# EasyEDA schematic 1-Schematic_Automatic watering Pump shield.json
TITLE: Pump Shield; REV: 1.0; Date: 2019-09-20; Sheet: 1/1; Drawn By: Tomáš Filo; Company: DIY
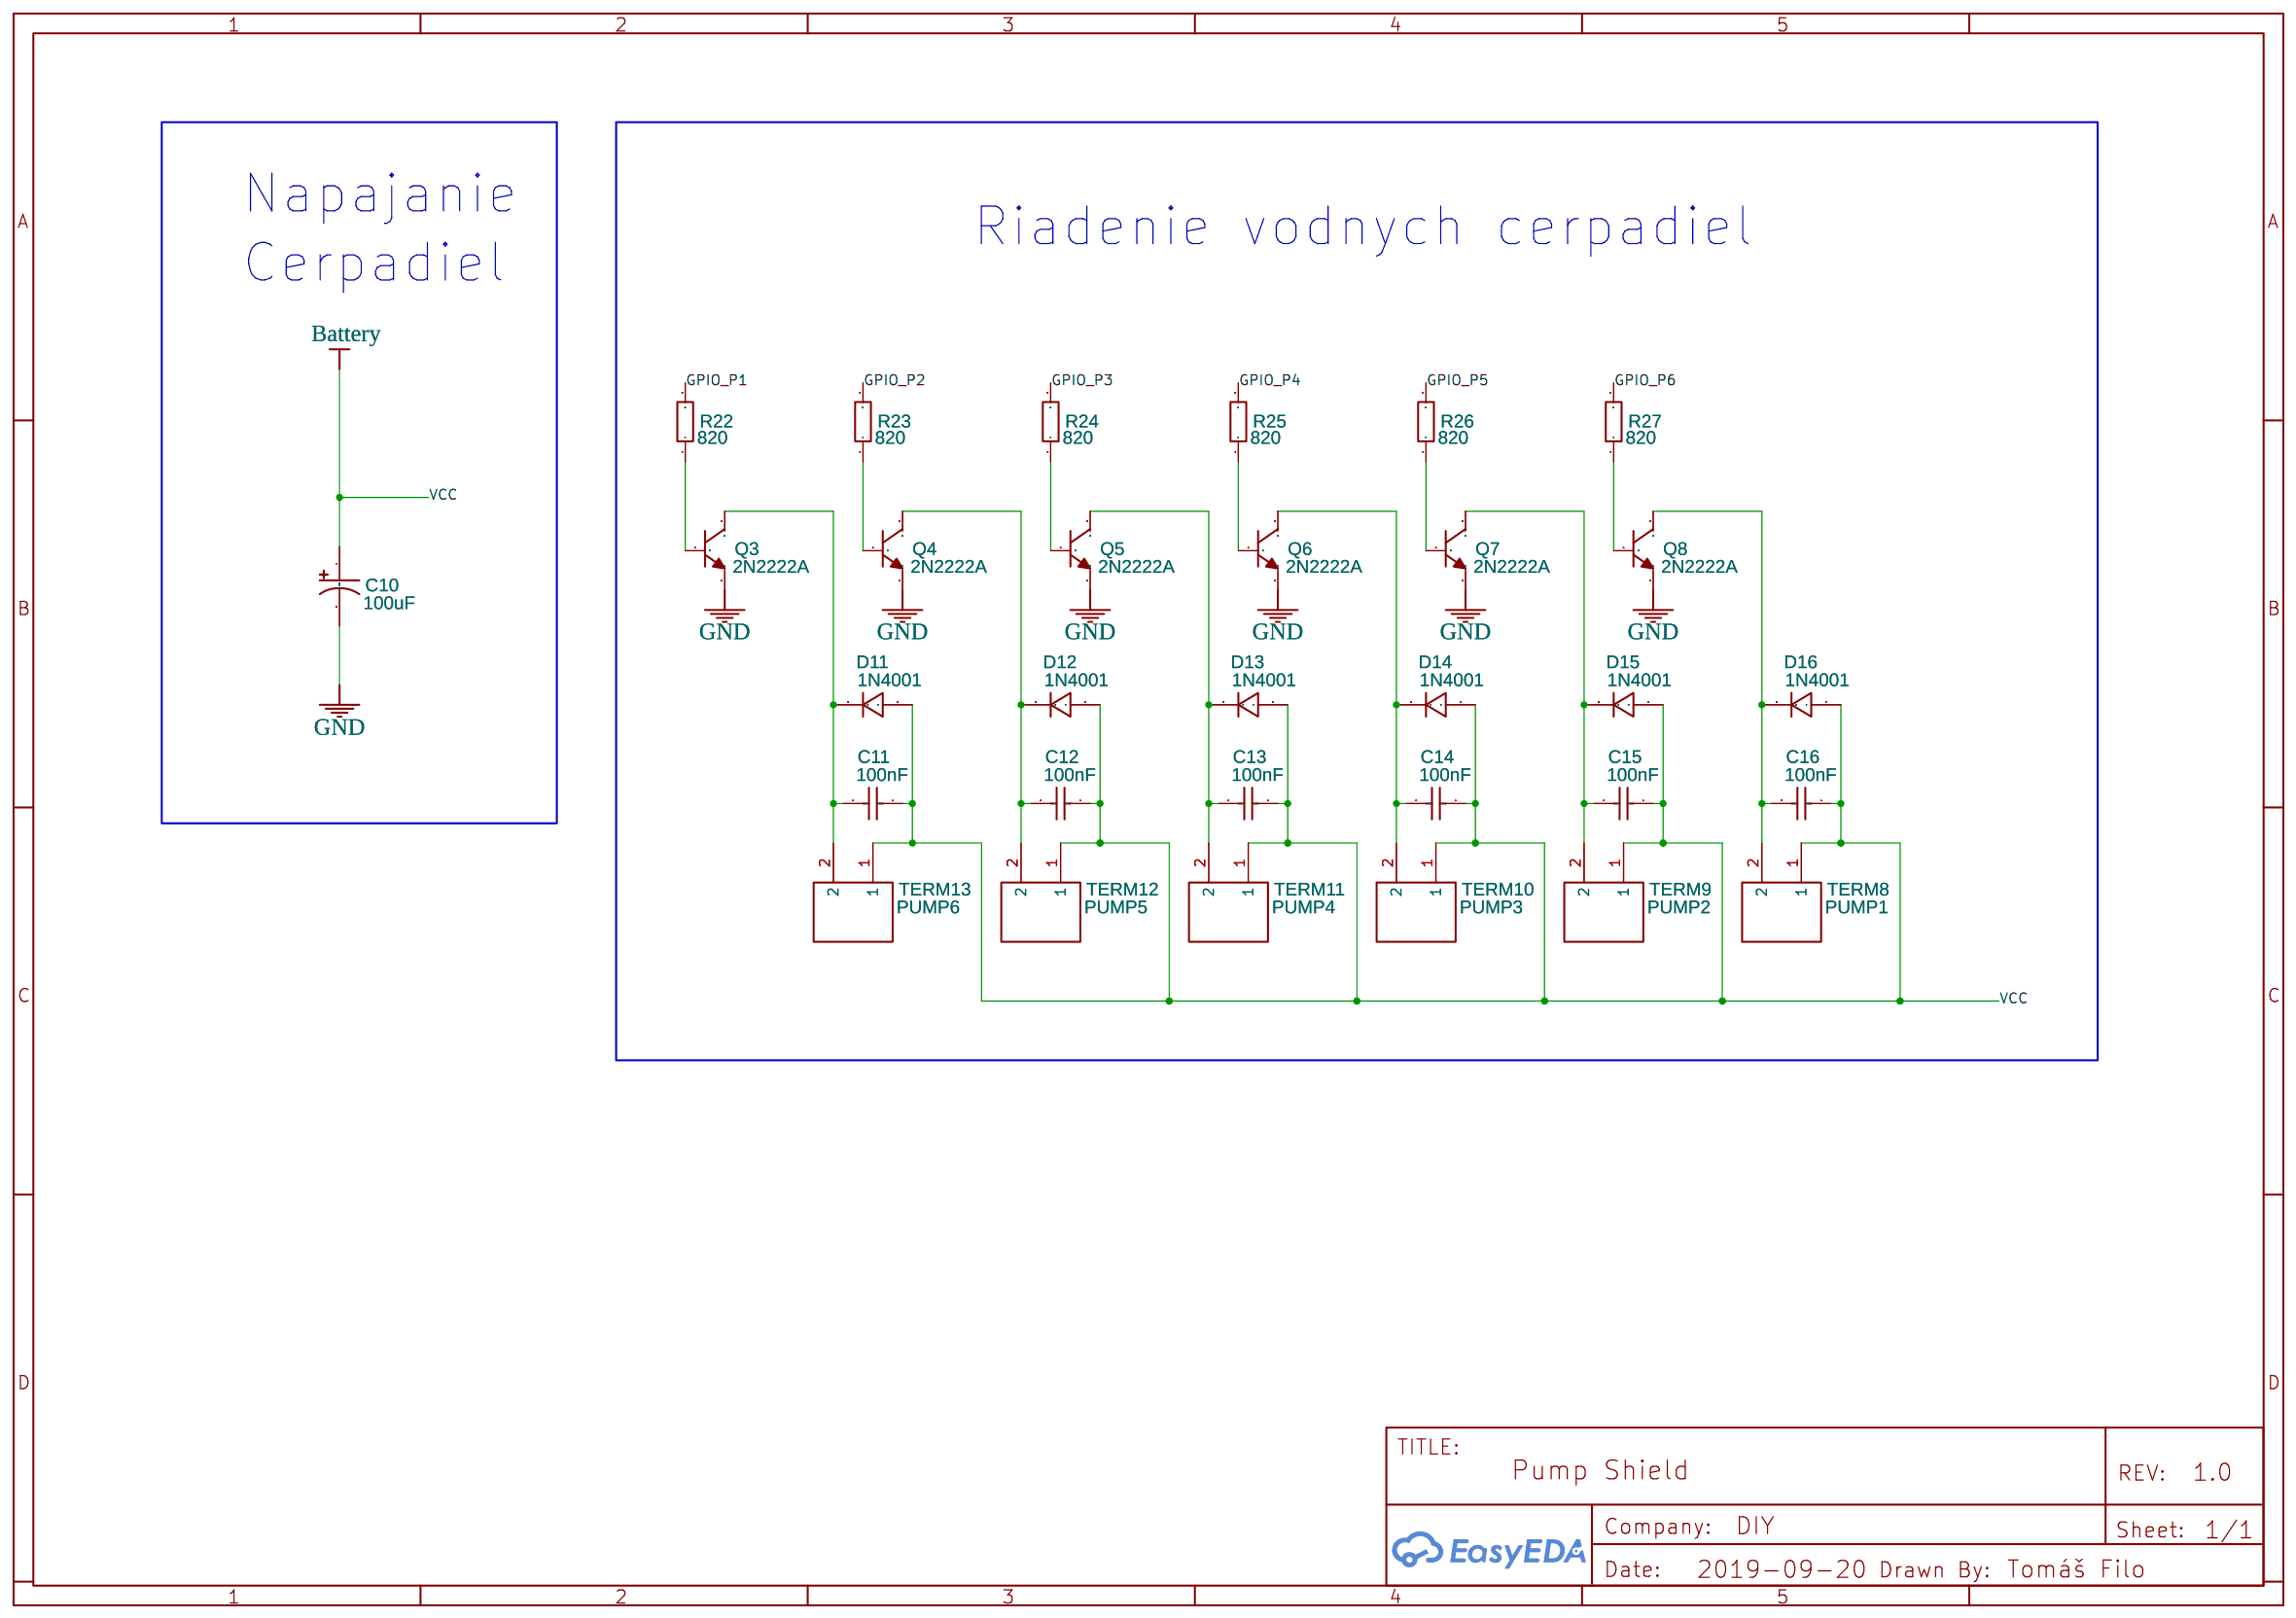
[diagram p0: schematic sheet]

## Parts
C10  100uF  [CAP-TH_D1.00-W5.00-PITCH5.00]
C11  100nF  [CAP-0.2]
C12  100nF  [CAP-0.2]
C13  100nF  [CAP-0.2]
C14  100nF  [CAP-0.2]
C15  100nF  [CAP-0.2]
C16  100nF  [CAP-0.2]
D11  1N4001  [DO-41]
D12  1N4001  [DO-41]
D13  1N4001  [DO-41]
D14  1N4001  [DO-41]
D15  1N4001  [DO-41]
D16  1N4001  [DO-41]
Q3  2N2222A  [TO-92(TO-92-3F)-2.54]
Q4  2N2222A  [TO-92(TO-92-3F)-2.54]
Q5  2N2222A  [TO-92(TO-92-3F)-2.54]
Q6  2N2222A  [TO-92(TO-92-3F)-2.54]
Q7  2N2222A  [TO-92(TO-92-3F)-2.54]
Q8  2N2222A  [TO-92(TO-92-3F)-2.54]
R22  820  [AXIAL-6.5X2.3(1/4W)]
R23  820  [AXIAL-6.5X2.3(1/4W)]
R24  820  [AXIAL-6.5X2.3(1/4W)]
R25  820  [AXIAL-6.5X2.3(1/4W)]
R26  820  [AXIAL-6.5X2.3(1/4W)]
R27  820  [AXIAL-6.5X2.3(1/4W)]
TERM8  PUMP1  [MKDSN1.5/2-5.08]
TERM9  PUMP2  [MKDSN1.5/2-5.08]
TERM10  PUMP3  [MKDSN1.5/2-5.08]
TERM11  PUMP4  [MKDSN1.5/2-5.08]
TERM12  PUMP5  [MKDSN1.5/2-5.08]
TERM13  PUMP6  [MKDSN1.5/2-5.08]

## Library data of the parts
C10 = SMS25VB47M5*11_5.0TP: Supplier: LCSC; Supplier Part: C371229; Manufacturer: SamYoung Electronics; Contributor: LCSC
C11-C16 = CD1H224KC9BER1E000: Supplier: LCSC; Supplier Part: C263191; Manufacturer: Dersonic; Contributor: LCSC
D11-D16 = -: Supplier Part: C169150; Supplier: LCSC; Manufacturer: DIOFIT; Contributor: LCSC
Q3-Q8 = -: Supplier: LCSC; Supplier Part: C358533; Manufacturer: Foshan Blue Rocket Elec; Contributor: LCSC
R22-R27 = MF1/4W-330Ω±1% T52: Supplier: LCSC; Supplier Part: C119313; Manufacturer: Chian Chia Elec; Contributor: LCSC
TERM8-TERM13 = -: Supplier: LCSC; Manufacturer: Phoenix Contact; Supplier Part: C91153

## Nets
GND: C10.2 Q3.3(E) Q4.3(E) Q5.3(E) Q6.3(E) Q7.3(E) Q8.3(E)
Battery: C10.1 C11.1 C12.1 C13.1 C14.1 C15.1 C16.1 D11.1 D12.1 D13.1 D14.1 D15.1 D16.1 TERM8.1 TERM9.1 TERM10.1 TERM11.1 TERM12.1 TERM13.1
GPIO_P1: R22.2
GPIO_P2: R23.2
GPIO_P3: R24.2
GPIO_P4: R25.2
GPIO_P5: R26.2
GPIO_P6: R27.2
Net-(C11-2): C11.2 D11.2 Q3.1(C) TERM13.2
Net-(C12-2): C12.2 D12.2 Q4.1(C) TERM12.2
Net-(C13-2): C13.2 D13.2 Q5.1(C) TERM11.2
Net-(C14-2): C14.2 D14.2 Q6.1(C) TERM10.2
Net-(C15-2): C15.2 D15.2 Q7.1(C) TERM9.2
Net-(C16-2): C16.2 D16.2 Q8.1(C) TERM8.2
Net-(Q3-2): Q3.2(B) R22.1
Net-(Q4-2): Q4.2(B) R23.1
Net-(Q5-2): Q5.2(B) R24.1
Net-(Q6-2): Q6.2(B) R25.1
Net-(Q7-2): Q7.2(B) R26.1
Net-(Q8-2): Q8.2(B) R27.1

## Notes on the sheet
- Napajanie
- Riadenie vodnych cerpadiel
- Cerpadiel
